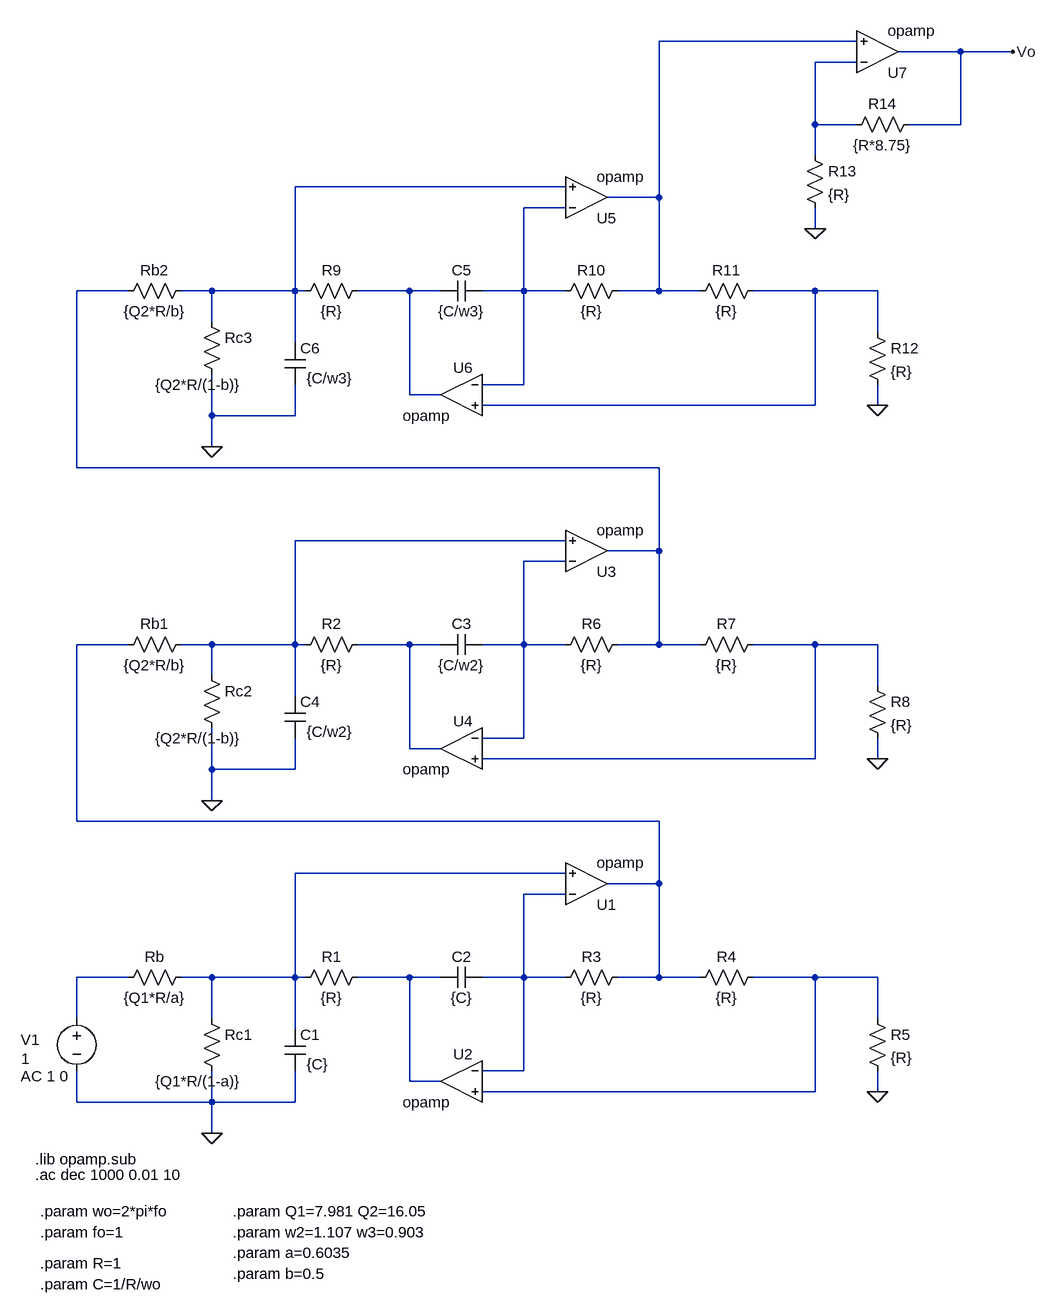
[diagram p0: schematic Implementacion activa.asc]
Implementacion activa.asc, the LTspice schematic file:
Version 4
SHEET 1 1168 680
WIRE 768 -1280 464 -1280
WIRE 928 -1264 832 -1264
WIRE 1008 -1264 928 -1264
WIRE 768 -1248 704 -1248
WIRE 704 -1152 704 -1248
WIRE 768 -1152 704 -1152
WIRE 928 -1152 928 -1264
WIRE 928 -1152 848 -1152
WIRE 704 -1104 704 -1152
WIRE 320 -1056 -96 -1056
WIRE 464 -1040 464 -1280
WIRE 464 -1040 384 -1040
WIRE 320 -1024 256 -1024
WIRE 704 -992 704 -1024
WIRE -352 -896 -432 -896
WIRE -224 -896 -272 -896
WIRE -96 -896 -96 -1056
WIRE -96 -896 -224 -896
WIRE -80 -896 -96 -896
WIRE 80 -896 0 -896
WIRE 128 -896 80 -896
WIRE 256 -896 256 -1024
WIRE 256 -896 192 -896
WIRE 320 -896 256 -896
WIRE 464 -896 464 -1040
WIRE 464 -896 400 -896
WIRE 528 -896 464 -896
WIRE 704 -896 608 -896
WIRE 800 -896 704 -896
WIRE -224 -848 -224 -896
WIRE 800 -832 800 -896
WIRE -96 -816 -96 -896
WIRE 256 -752 256 -896
WIRE 256 -752 192 -752
WIRE 80 -736 80 -896
WIRE 128 -736 80 -736
WIRE 704 -720 704 -896
WIRE 704 -720 192 -720
WIRE 800 -720 800 -752
WIRE -224 -704 -224 -768
WIRE -96 -704 -96 -752
WIRE -96 -704 -224 -704
WIRE -224 -656 -224 -704
WIRE -432 -624 -432 -896
WIRE 464 -624 -432 -624
WIRE 320 -512 -96 -512
WIRE 464 -496 464 -624
WIRE 464 -496 384 -496
WIRE 320 -480 256 -480
WIRE -352 -352 -432 -352
WIRE -224 -352 -272 -352
WIRE -96 -352 -96 -512
WIRE -96 -352 -224 -352
WIRE -80 -352 -96 -352
WIRE 80 -352 0 -352
WIRE 128 -352 80 -352
WIRE 256 -352 256 -480
WIRE 256 -352 192 -352
WIRE 320 -352 256 -352
WIRE 464 -352 464 -496
WIRE 464 -352 400 -352
WIRE 528 -352 464 -352
WIRE 704 -352 608 -352
WIRE 800 -352 704 -352
WIRE -224 -304 -224 -352
WIRE 800 -288 800 -352
WIRE -96 -272 -96 -352
WIRE 256 -208 256 -352
WIRE 256 -208 192 -208
WIRE 80 -192 80 -352
WIRE 128 -192 80 -192
WIRE 704 -176 704 -352
WIRE 704 -176 192 -176
WIRE 800 -176 800 -208
WIRE -224 -160 -224 -224
WIRE -96 -160 -96 -208
WIRE -96 -160 -224 -160
WIRE -224 -112 -224 -160
WIRE -432 -80 -432 -352
WIRE 464 -80 -432 -80
WIRE 320 0 -96 0
WIRE 464 16 464 -80
WIRE 464 16 384 16
WIRE 320 32 256 32
WIRE -352 160 -432 160
WIRE -224 160 -272 160
WIRE -96 160 -96 0
WIRE -96 160 -224 160
WIRE -80 160 -96 160
WIRE 80 160 0 160
WIRE 128 160 80 160
WIRE 256 160 256 32
WIRE 256 160 192 160
WIRE 320 160 256 160
WIRE 464 160 464 16
WIRE 464 160 400 160
WIRE 528 160 464 160
WIRE 704 160 608 160
WIRE 800 160 704 160
WIRE -432 224 -432 160
WIRE -224 224 -224 160
WIRE 800 224 800 160
WIRE -96 240 -96 160
WIRE 256 304 256 160
WIRE 256 304 192 304
WIRE 80 320 80 160
WIRE 128 320 80 320
WIRE 704 336 704 160
WIRE 704 336 192 336
WIRE 800 336 800 304
WIRE -432 352 -432 304
WIRE -224 352 -224 304
WIRE -224 352 -432 352
WIRE -96 352 -96 304
WIRE -96 352 -224 352
WIRE -224 400 -224 352
FLAG 800 336 0
FLAG -224 400 0
FLAG 800 -176 0
FLAG -224 -112 0
FLAG 800 -720 0
FLAG -224 -656 0
FLAG 1008 -1264 Vo
FLAG 704 -992 0
SYMBOL OpAmps\\opamp 352 80 M180
SYMATTR InstName U1
SYMBOL res 16 144 R90
WINDOW 0 0 56 VBottom 2
WINDOW 3 32 56 VTop 2
SYMATTR InstName R1
SYMATTR Value {R}
SYMBOL cap 192 144 R90
WINDOW 0 0 32 VBottom 2
WINDOW 3 32 32 VTop 2
SYMATTR InstName C2
SYMATTR Value {C}
SYMBOL res 416 144 R90
WINDOW 0 0 56 VBottom 2
WINDOW 3 32 56 VTop 2
SYMATTR InstName R3
SYMATTR Value {R}
SYMBOL res 624 144 R90
WINDOW 0 0 56 VBottom 2
WINDOW 3 32 56 VTop 2
SYMATTR InstName R4
SYMATTR Value {R}
SYMBOL OpAmps\\opamp 160 256 M0
WINDOW 0 -18 22 Left 2
SYMATTR InstName U2
SYMBOL res 784 208 R0
SYMATTR InstName R5
SYMATTR Value {R}
SYMBOL voltage -432 208 R0
WINDOW 0 -86 48 Left 2
WINDOW 3 -85 77 Left 2
WINDOW 123 -86 104 Left 2
WINDOW 39 0 0 Left 0
SYMATTR InstName V1
SYMATTR Value 1
SYMATTR Value2 AC 1 0
SYMBOL res -256 144 R90
WINDOW 0 0 56 VBottom 2
WINDOW 3 32 56 VTop 2
SYMATTR InstName Rb
SYMATTR Value {Q1*R/a}
SYMBOL res -240 208 R0
WINDOW 3 -71 112 Left 2
SYMATTR Value {Q1*R/(1-a)}
SYMATTR InstName Rc1
SYMBOL cap -112 240 R0
WINDOW 3 34 54 Left 2
SYMATTR Value {C}
SYMATTR InstName C1
SYMBOL OpAmps\\opamp 352 -432 M180
SYMATTR InstName U3
SYMBOL res 16 -368 R90
WINDOW 0 0 56 VBottom 2
WINDOW 3 32 56 VTop 2
SYMATTR InstName R2
SYMATTR Value {R}
SYMBOL cap 192 -368 R90
WINDOW 0 0 32 VBottom 2
WINDOW 3 32 32 VTop 2
SYMATTR InstName C3
SYMATTR Value {C/w2}
SYMBOL res 416 -368 R90
WINDOW 0 0 56 VBottom 2
WINDOW 3 32 56 VTop 2
SYMATTR InstName R6
SYMATTR Value {R}
SYMBOL res 624 -368 R90
WINDOW 0 0 56 VBottom 2
WINDOW 3 32 56 VTop 2
SYMATTR InstName R7
SYMATTR Value {R}
SYMBOL OpAmps\\opamp 160 -256 M0
WINDOW 0 -18 22 Left 2
SYMATTR InstName U4
SYMBOL res 784 -304 R0
SYMATTR InstName R8
SYMATTR Value {R}
SYMBOL res -256 -368 R90
WINDOW 0 0 56 VBottom 2
WINDOW 3 32 56 VTop 2
SYMATTR InstName Rb1
SYMATTR Value {Q2*R/b}
SYMBOL cap -112 -272 R0
WINDOW 3 34 54 Left 2
SYMATTR Value {C/w2}
SYMATTR InstName C4
SYMBOL OpAmps\\opamp 352 -976 M180
SYMATTR InstName U5
SYMBOL res 16 -912 R90
WINDOW 0 0 56 VBottom 2
WINDOW 3 32 56 VTop 2
SYMATTR InstName R9
SYMATTR Value {R}
SYMBOL cap 192 -912 R90
WINDOW 0 0 32 VBottom 2
WINDOW 3 32 32 VTop 2
SYMATTR InstName C5
SYMATTR Value {C/w3}
SYMBOL res 416 -912 R90
WINDOW 0 0 56 VBottom 2
WINDOW 3 32 56 VTop 2
SYMATTR InstName R10
SYMATTR Value {R}
SYMBOL res 624 -912 R90
WINDOW 0 0 56 VBottom 2
WINDOW 3 32 56 VTop 2
SYMATTR InstName R11
SYMATTR Value {R}
SYMBOL OpAmps\\opamp 160 -800 M0
WINDOW 0 -18 22 Left 2
SYMATTR InstName U6
SYMBOL res 784 -848 R0
SYMATTR InstName R12
SYMATTR Value {R}
SYMBOL res -256 -912 R90
WINDOW 0 0 56 VBottom 2
WINDOW 3 32 56 VTop 2
SYMATTR InstName Rb2
SYMATTR Value {Q2*R/b}
SYMBOL cap -112 -816 R0
WINDOW 3 34 54 Left 2
SYMATTR Value {C/w3}
SYMATTR InstName C6
SYMBOL OpAmps\\opamp 800 -1200 M180
SYMATTR InstName U7
SYMBOL res 688 -1120 R0
SYMATTR InstName R13
SYMATTR Value {R}
SYMBOL res 864 -1168 R90
WINDOW 0 0 56 VBottom 2
WINDOW 3 32 56 VTop 2
SYMATTR InstName R14
SYMATTR Value {R*8.75}
SYMBOL res -240 -320 R0
WINDOW 3 -71 112 Left 2
SYMATTR Value {Q2*R/(1-b)}
SYMATTR InstName Rc2
SYMBOL res -240 -864 R0
WINDOW 3 -71 112 Left 2
SYMATTR Value {Q2*R/(1-b)}
SYMATTR InstName Rc3
TEXT -496 440 Left 2 !.lib opamp.sub
TEXT -496 464 Left 2 !.ac dec 1000 0.01 10
TEXT -488 520 Left 2 !.param wo=2*pi*fo
TEXT -488 552 Left 2 !.param fo=1
TEXT -488 600 Left 2 !.param R=1
TEXT -192 520 Left 2 !.param Q1=7.981 Q2=16.05
TEXT -192 552 Left 2 !.param w2=1.107 w3=0.903
TEXT -192 584 Left 2 !.param a=0.6035
TEXT -488 632 Left 2 !.param C=1/R/wo
TEXT -192 616 Left 2 !.param b=0.5

The netlist it stands for:
* Implementacion activa.asc
XU1 N014 N013 N010 opamp Aol=100K GBW=10Meg  ; pins invin noninvin out
R1 N016 N013 {R}
C2 N014 N016 {C}
R3 N010 N014 {R}
R4 N017 N010 {R}
XU2 N014 N017 N016 opamp Aol=100K GBW=10Meg  ; pins invin noninvin out
R5 N017 0 {R}
V1 N015 0 1 AC 1 0
Rb N013 N015 {Q1*R/a}
Rc1 N013 0 {Q1*R/(1-a)}
C1 N013 0 {C}
XU3 N009 N008 N005 opamp Aol=100K GBW=10Meg  ; pins invin noninvin out
R2 N011 N008 {R}
C3 N009 N011 {C/w2}
R6 N005 N009 {R}
R7 N012 N005 {R}
XU4 N009 N012 N011 opamp Aol=100K GBW=10Meg  ; pins invin noninvin out
R8 N012 0 {R}
Rb1 N008 N010 {Q2*R/b}
C4 N008 0 {C/w2}
XU5 N004 N003 N001 opamp Aol=100K GBW=10Meg  ; pins invin noninvin out
R9 N006 N003 {R}
C5 N004 N006 {C/w3}
R10 N001 N004 {R}
R11 N007 N001 {R}
XU6 N004 N007 N006 opamp Aol=100K GBW=10Meg  ; pins invin noninvin out
R12 N007 0 {R}
Rb2 N003 N005 {Q2*R/b}
C6 N003 0 {C/w3}
XU7 N002 N001 Vo opamp Aol=100K GBW=10Meg  ; pins invin noninvin out
R13 N002 0 {R}
R14 Vo N002 {R*8.75}
Rc2 N008 0 {Q2*R/(1-b)}
Rc3 N003 0 {Q2*R/(1-b)}
.lib opamp.sub
.ac dec 1000 0.01 10
.param wo=2*pi*fo
.param fo=1
.param R=1
.param Q1=7.981 Q2=16.05
.param w2=1.107 w3=0.903
.param a=0.6035
.param C=1/R/wo
.param b=0.5
.backanno
.end